# EasyEDA schematic joystick.json
TITLE: KY-023 XY axis joystick module; REV: 1.1; Date: 2025-08-15; Sheet: 1/1; Drawn By: adrirobot; Company: www.adrirobot.it
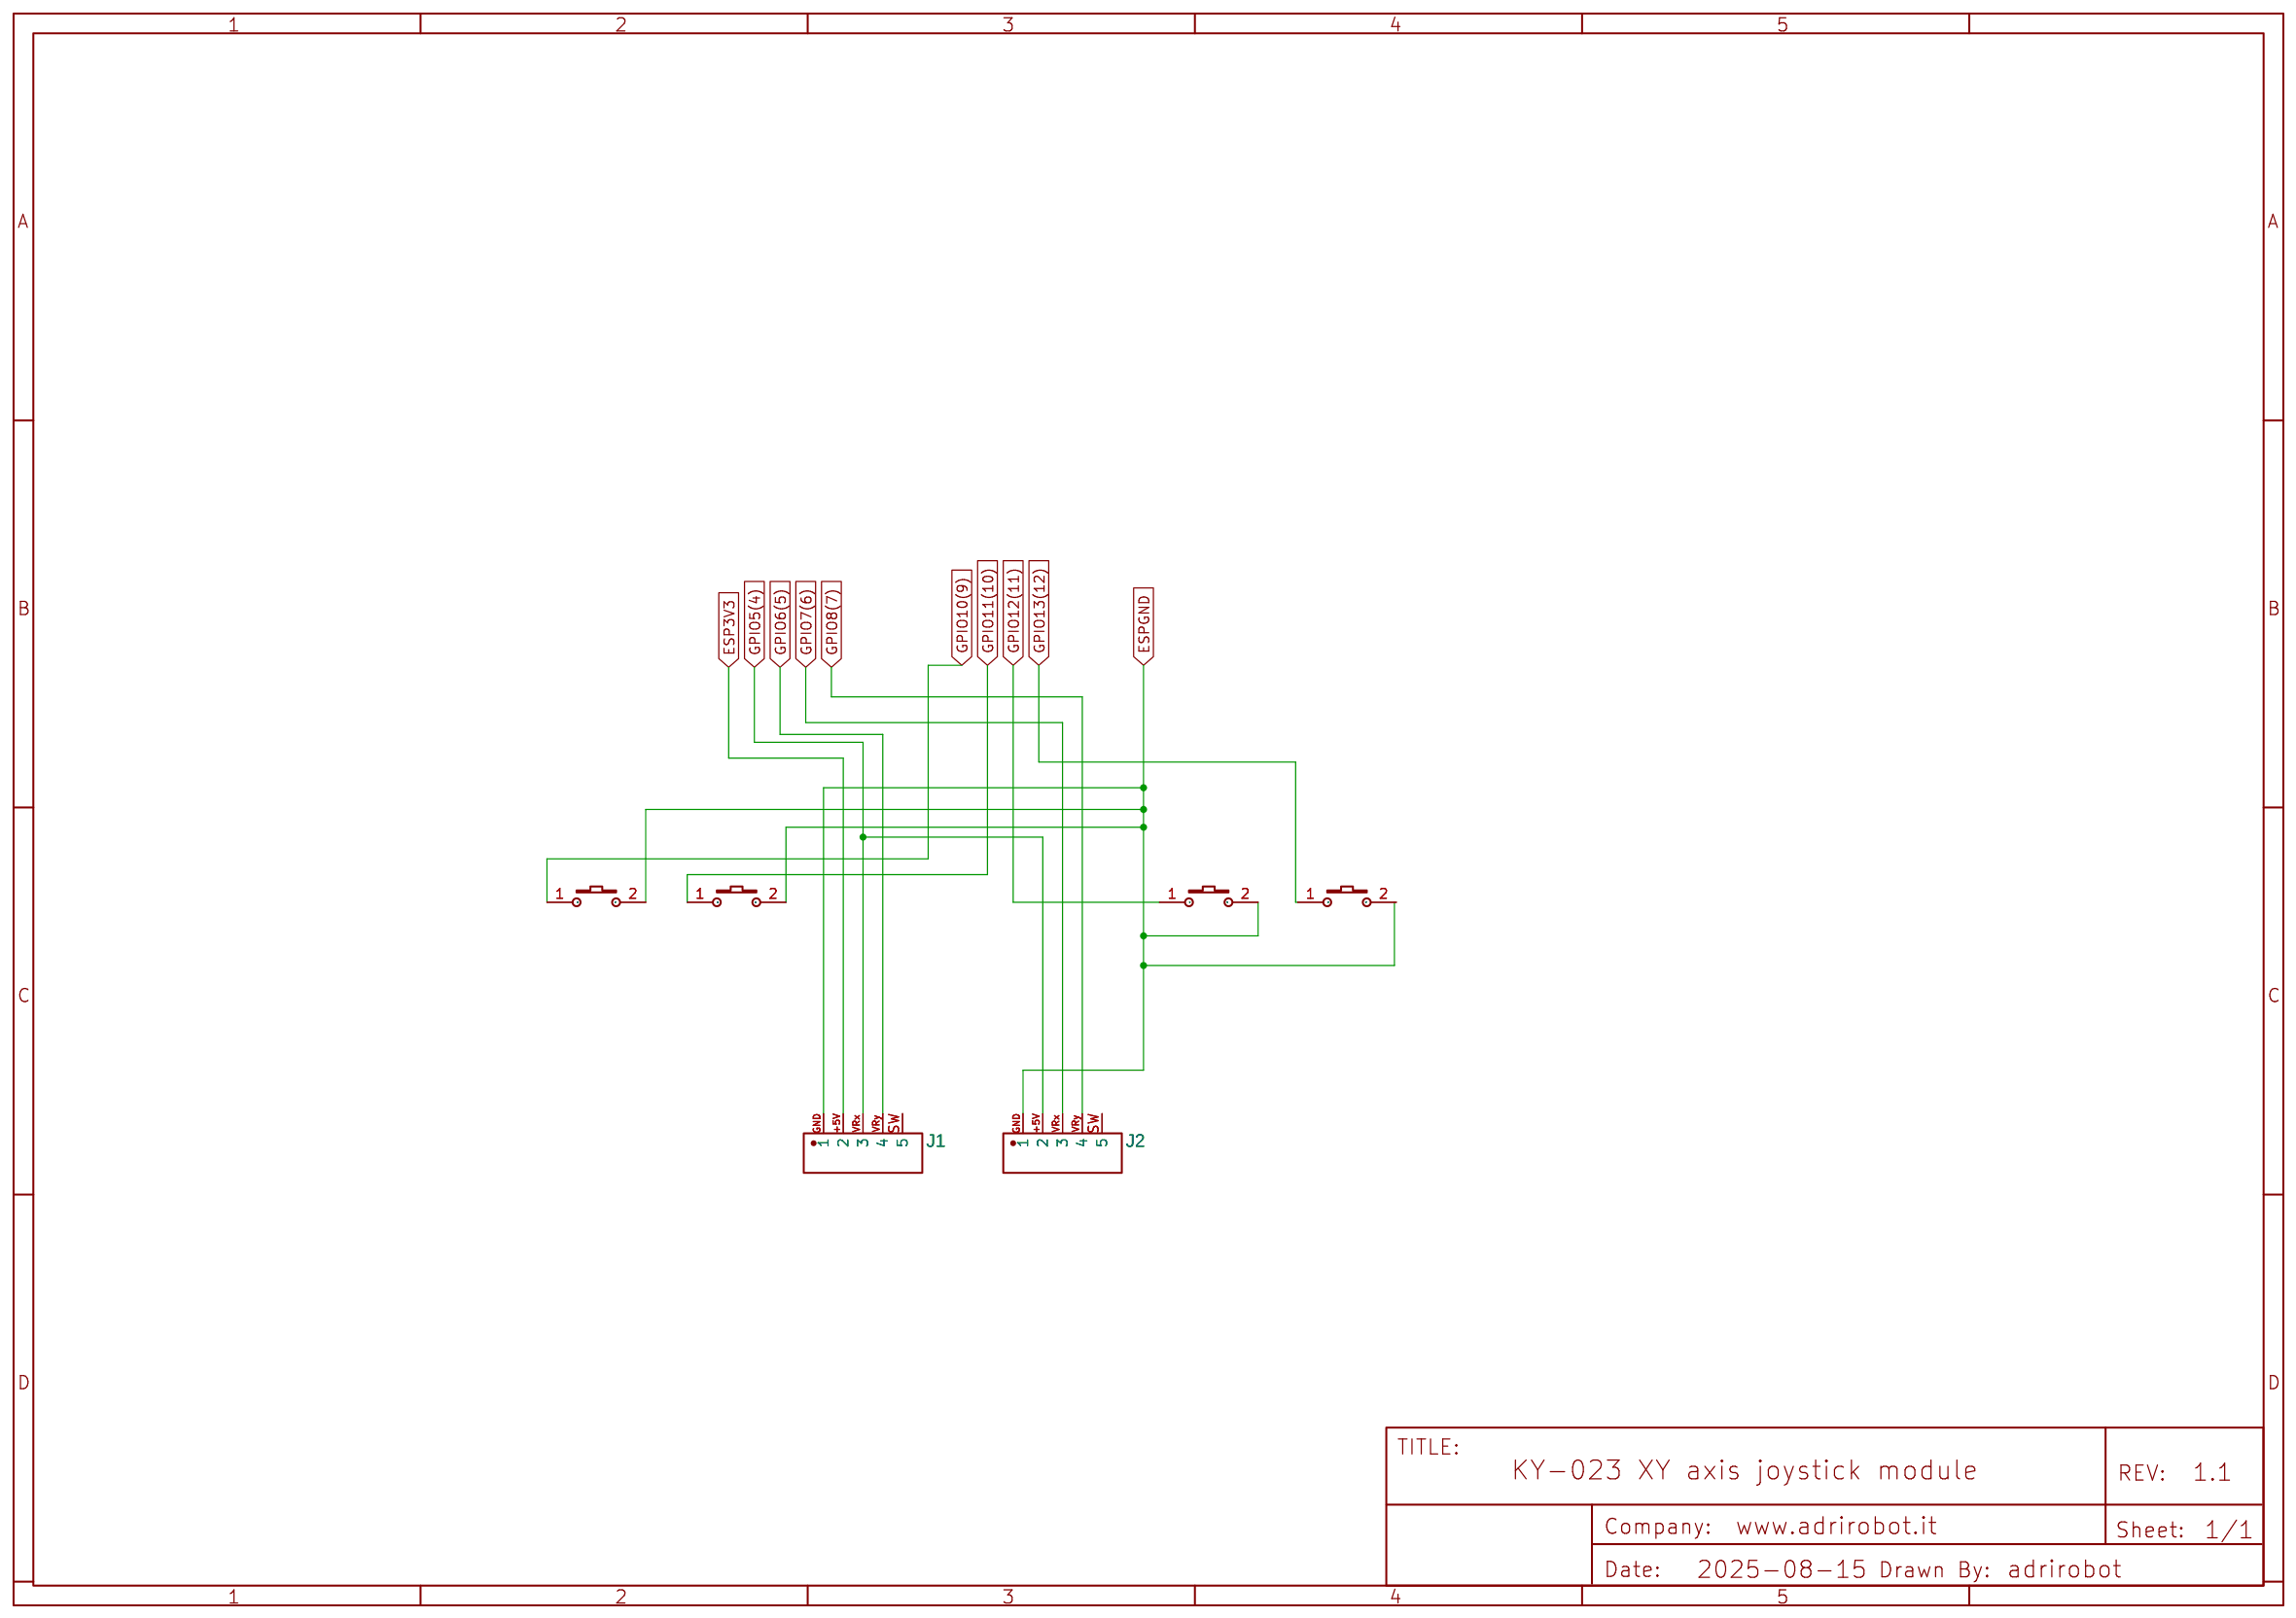
[diagram p0: schematic sheet]

## Parts
J1  HX PZ2.54-1X5P WZ-P  [HDR-TH_5P-P2.54-H-M-W7.7-P]
J2  HX PZ2.54-1X5P WZ-P  [HDR-TH_5P-P2.54-H-M-W7.7-P]
KEY1  K2-3.6×6.1_SMD  [KEY-SMD_2P-L6.2-W3.6-LS8.0]
KEY2  K2-3.6×6.1_SMD  [KEY-SMD_2P-L6.2-W3.6-LS8.0]
KEY3  K2-3.6×6.1_SMD  [KEY-SMD_2P-L6.2-W3.6-LS8.0]
KEY4  K2-3.6×6.1_SMD  [KEY-SMD_2P-L6.2-W3.6-LS8.0]

## Library data of the parts
J1 J2 = HX PZ2.54-1X5P WZ-P: Supplier: LCSC; Supplier Part: C42453954; Manufacturer: hanxia(韩下); Manufacturer Part: HX PZ2.54-1x5P WZ-P; JLCPCB Part Class: Extended Part; Contributor: lcsc
KEY1-KEY4 = K2-3.6×6.1_SMD: Supplier Part: C118141; Supplier: LCSC; Manufacturer Part: K2-1107ST-A4SW-06; Contributor: LCEDA_Lib; 制造商: 韩国韩荣

## Nets
ESP3V3: J1.+5V(2)
ESPGND: J1.GND(1) J2.GND(1) KEY1.2 KEY2.2 KEY3.2
GPIO5(4): J1.VRx(3) J2.+5V(2)
GPIO6(5): J1.VRy(4)
GPIO7(6): J2.VRx(3)
GPIO8(7): J2.VRy(4)
GPIO10(9): KEY1.1
GPIO11(10): KEY2.1
GPIO12(11): KEY3.1
GPIO13(12): KEY4.1

Not connected (* = marked no-connect by the designer): J1 SW(5); J2 SW(5); KEY4 2
